# Altium schematic sheet [05]-CPU-UART,SPI.SchDoc: S32K1_CONTROLLER
size A3; SheetNumber: 05; SheetTotal: 11
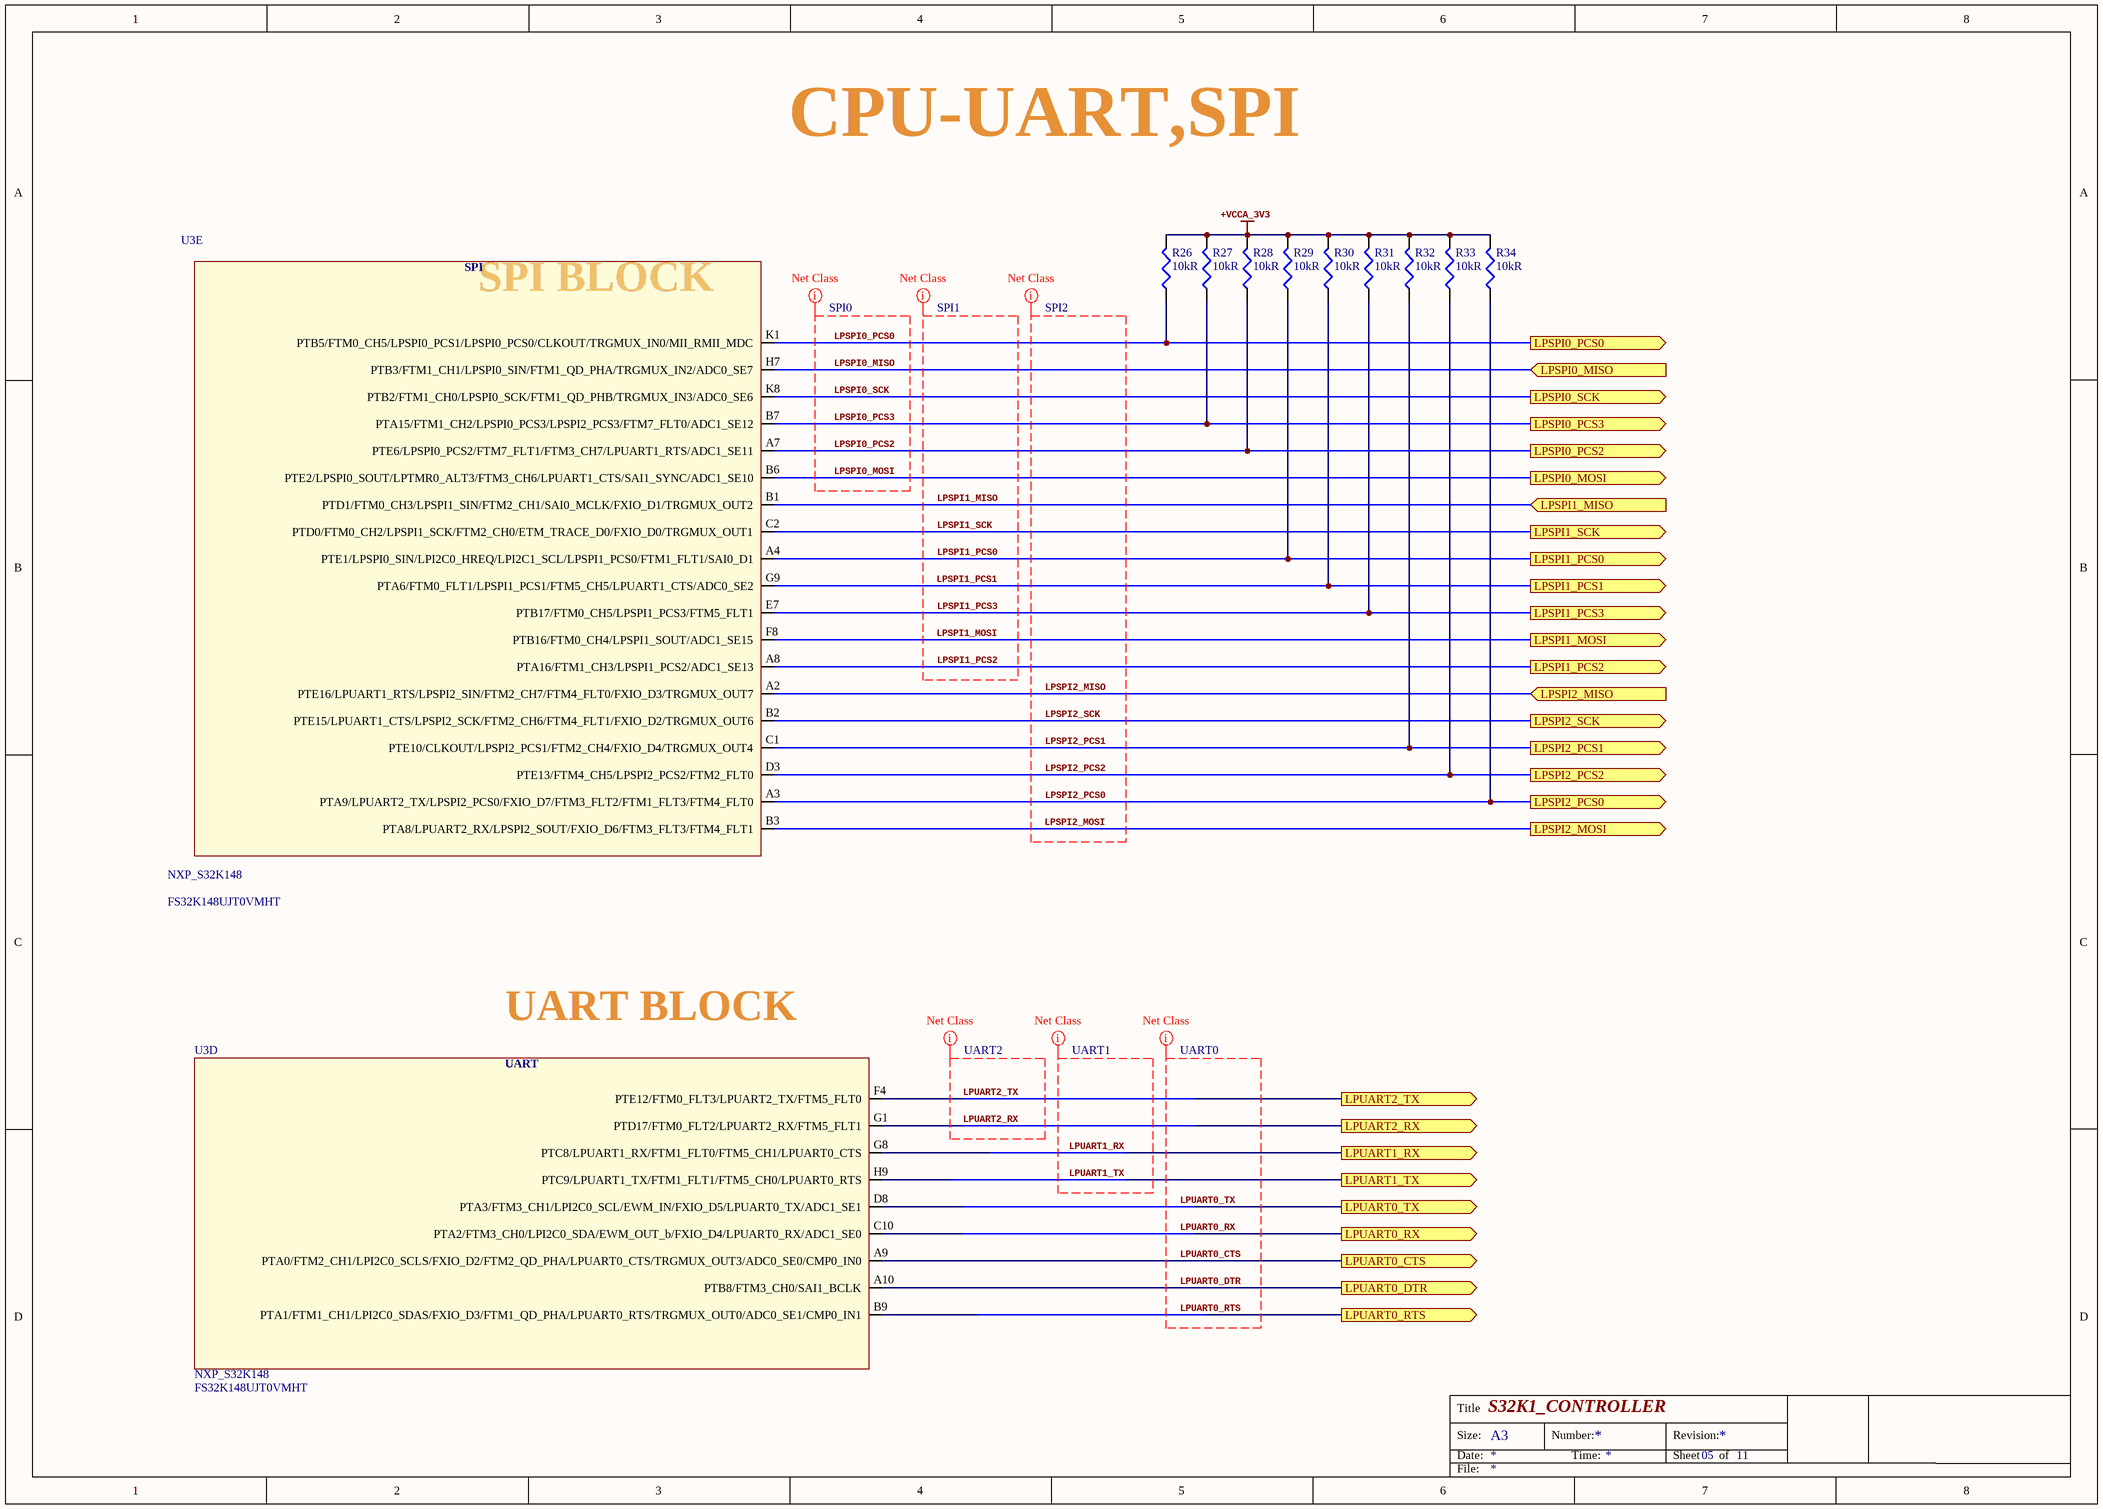
[diagram p0: [05]-CPU-UART,SPI.SchDoc]

## Parts
R26  Resistance: 10kR  [RES0402]  (hidden comment: ERJ-2GEJ103X)
R27  Resistance: 10kR  [RES0402]  (hidden comment: ERJ-2GEJ103X)
R28  Resistance: 10kR  [RES0402]  (hidden comment: ERJ-2GEJ103X)
R29  Resistance: 10kR  [RES0402]  (hidden comment: ERJ-2GEJ103X)
R30  Resistance: 10kR  [RES0402]  (hidden comment: ERJ-2GEJ103X)
R31  Resistance: 10kR  [RES0402]  (hidden comment: ERJ-2GEJ103X)
R32  Resistance: 10kR  [RES0402]  (hidden comment: ERJ-2GEJ103X)
R33  Resistance: 10kR  [RES0402]  (hidden comment: ERJ-2GEJ103X)
R34  Resistance: 10kR  [RES0402]  (hidden comment: ERJ-2GEJ103X)
U3  NXP_S32K148  Manufacturer Part Number: FS32K148UJT0VMHT  [WEONREFERENCEPLATFORM_100MAPBGA]  (parts D,E of 8)

## Ports
LPSPI0_MISO (in), LPSPI0_MOSI (out), LPSPI0_PCS0 (out), LPSPI0_PCS2 (out), LPSPI0_PCS3 (out), LPSPI0_SCK (out), LPSPI1_MISO (in), LPSPI1_MOSI (out), LPSPI1_PCS0 (out), LPSPI1_PCS1 (out), LPSPI1_PCS2 (out), LPSPI1_PCS3 (out), LPSPI1_SCK (out), LPSPI2_MISO (in), LPSPI2_MOSI (out), LPSPI2_PCS0 (out), LPSPI2_PCS1 (out), LPSPI2_PCS2 (out), LPSPI2_SCK (out), LPUART0_CTS (out), LPUART0_DTR (out), LPUART0_RTS (out), LPUART0_RX (out), LPUART0_TX (out), LPUART1_RX (out), LPUART1_TX (out), LPUART2_RX (out), LPUART2_TX (out)

## Nets
+VCCA_3V3: R26.2 R27.2 R28.2 R29.2 R30.2 R31.2 R32.2 R33.2 R34.2
LPSPI0_MISO: U3.H7(PTB3/FTM1_CH1/LPSPI0_SIN/FTM1_QD_PHA/TRGMUX_IN2/ADC0_SE7) ; port LPSPI0_MISO
LPSPI0_MOSI: U3.B6(PTE2/LPSPI0_SOUT/LPTMR0_ALT3/FTM3_CH6/LPUART1_CTS/SAI1_SYNC/ADC1_SE10) ; port LPSPI0_MOSI
LPSPI0_PCS0: R26.1 U3.K1(PTB5/FTM0_CH5/LPSPI0_PCS1/LPSPI0_PCS0/CLKOUT/TRGMUX_IN0/MII_RMII_MDC) ; port LPSPI0_PCS0
LPSPI0_PCS2: R28.1 U3.A7(PTE6/LPSPI0_PCS2/FTM7_FLT1/FTM3_CH7/LPUART1_RTS/ADC1_SE11) ; port LPSPI0_PCS2
LPSPI0_PCS3: R27.1 U3.B7(PTA15/FTM1_CH2/LPSPI0_PCS3/LPSPI2_PCS3/FTM7_FLT0/ADC1_SE12) ; port LPSPI0_PCS3
LPSPI0_SCK: U3.K8(PTB2/FTM1_CH0/LPSPI0_SCK/FTM1_QD_PHB/TRGMUX_IN3/ADC0_SE6) ; port LPSPI0_SCK
LPSPI1_MISO: U3.B1(PTD1/FTM0_CH3/LPSPI1_SIN/FTM2_CH1/SAI0_MCLK/FXIO_D1/TRGMUX_OUT2) ; port LPSPI1_MISO
LPSPI1_MOSI: U3.F8(PTB16/FTM0_CH4/LPSPI1_SOUT/ADC1_SE15) ; port LPSPI1_MOSI
LPSPI1_PCS0: R29.1 U3.A4(PTE1/LPSPI0_SIN/LPI2C0_HREQ/LPI2C1_SCL/LPSPI1_PCS0/FTM1_FLT1/SAI0_D1) ; port LPSPI1_PCS0
LPSPI1_PCS1: R30.1 U3.G9(PTA6/FTM0_FLT1/LPSPI1_PCS1/FTM5_CH5/LPUART1_CTS/ADC0_SE2) ; port LPSPI1_PCS1
LPSPI1_PCS2: U3.A8(PTA16/FTM1_CH3/LPSPI1_PCS2/ADC1_SE13) ; port LPSPI1_PCS2
LPSPI1_PCS3: R31.1 U3.E7(PTB17/FTM0_CH5/LPSPI1_PCS3/FTM5_FLT1) ; port LPSPI1_PCS3
LPSPI1_SCK: U3.C2(PTD0/FTM0_CH2/LPSPI1_SCK/FTM2_CH0/ETM_TRACE_D0/FXIO_D0/TRGMUX_OUT1) ; port LPSPI1_SCK
LPSPI2_MISO: U3.A2(PTE16/LPUART1_RTS/LPSPI2_SIN/FTM2_CH7/FTM4_FLT0/FXIO_D3/TRGMUX_OUT7) ; port LPSPI2_MISO
LPSPI2_MOSI: U3.B3(PTA8/LPUART2_RX/LPSPI2_SOUT/FXIO_D6/FTM3_FLT3/FTM4_FLT1) ; port LPSPI2_MOSI
LPSPI2_PCS0: R34.1 U3.A3(PTA9/LPUART2_TX/LPSPI2_PCS0/FXIO_D7/FTM3_FLT2/FTM1_FLT3/FTM4_FLT0) ; port LPSPI2_PCS0
LPSPI2_PCS1: R32.1 U3.C1(PTE10/CLKOUT/LPSPI2_PCS1/FTM2_CH4/FXIO_D4/TRGMUX_OUT4) ; port LPSPI2_PCS1
LPSPI2_PCS2: R33.1 U3.D3(PTE13/FTM4_CH5/LPSPI2_PCS2/FTM2_FLT0) ; port LPSPI2_PCS2
LPSPI2_SCK: U3.B2(PTE15/LPUART1_CTS/LPSPI2_SCK/FTM2_CH6/FTM4_FLT1/FXIO_D2/TRGMUX_OUT6) ; port LPSPI2_SCK
LPUART0_CTS: U3.A9(PTA0/FTM2_CH1/LPI2C0_SCLS/FXIO_D2/FTM2_QD_PHA/LPUART0_CTS/TRGMUX_OUT3/ADC0_SE0/CMP0_IN0) ; port LPUART0_CTS
LPUART0_DTR: U3.A10(PTB8/FTM3_CH0/SAI1_BCLK) ; port LPUART0_DTR
LPUART0_RTS: U3.B9(PTA1/FTM1_CH1/LPI2C0_SDAS/FXIO_D3/FTM1_QD_PHA/LPUART0_RTS/TRGMUX_OUT0/ADC0_SE1/CMP0_IN1) ; port LPUART0_RTS
LPUART0_RX: U3.C10(PTA2/FTM3_CH0/LPI2C0_SDA/EWM_OUT_b/FXIO_D4/LPUART0_RX/ADC1_SE0) ; port LPUART0_RX
LPUART0_TX: U3.D8(PTA3/FTM3_CH1/LPI2C0_SCL/EWM_IN/FXIO_D5/LPUART0_TX/ADC1_SE1) ; port LPUART0_TX
LPUART1_RX: U3.G8(PTC8/LPUART1_RX/FTM1_FLT0/FTM5_CH1/LPUART0_CTS) ; port LPUART1_RX
LPUART1_TX: U3.H9(PTC9/LPUART1_TX/FTM1_FLT1/FTM5_CH0/LPUART0_RTS) ; port LPUART1_TX
LPUART2_RX: U3.G1(PTD17/FTM0_FLT2/LPUART2_RX/FTM5_FLT1) ; port LPUART2_RX
LPUART2_TX: U3.F4(PTE12/FTM0_FLT3/LPUART2_TX/FTM5_FLT0) ; port LPUART2_TX

## Layout directives
net class SPI0: LPSPI0_MISO, LPSPI0_MOSI, LPSPI0_PCS0, LPSPI0_PCS2, LPSPI0_PCS3, LPSPI0_SCK
net class SPI1: LPSPI1_MISO, LPSPI1_MOSI, LPSPI1_PCS0, LPSPI1_PCS1, LPSPI1_PCS2, LPSPI1_PCS3, LPSPI1_SCK
net class SPI2: LPSPI2_MISO, LPSPI2_MOSI, LPSPI2_PCS0, LPSPI2_PCS1, LPSPI2_PCS2, LPSPI2_SCK
net class UART2: LPUART2_RX, LPUART2_TX
net class UART1: LPUART1_RX, LPUART1_TX
net class UART0: LPUART0_CTS, LPUART0_DTR, LPUART0_RTS, LPUART0_RX, LPUART0_TX

## Notes on the sheet
- CPU-UART,SPI
- SPI BLOCK
- UART BLOCK
- Labels drawn without touching a wire or pin: +VCCA_3V3
- Title
- Size:
- Date:
- A3
- Number:
- Time:
- Revision:
- Sheet
- of
- File:
- (in symbol NXP_S32K148, part D) UART
- (in symbol NXP_S32K148, part E) SPI

## Library data of the parts
R26-R34 = ERJ-2GEJ103X: Res Thick Film 0402 10K Ohm 5% 1/10W ±200ppm/°C Molded SMD SMD Punched Carrier T/R; Manufacturer: Panasonic; Power Rating: 100mW; Voltage Rating: 50V; Supplier 1: Digi-Key; Manufacturer Part Number: ERJ-2GEJ103X; Stock 1: 15334974; Pricing 1: 1 = 0.10000, 10 = 0.03100, 100 = 0.01250, 1000 = 0.00560, 2500 = 0.00486, 5000 = 0.00401 (USD); Mount: Surface Mount; Case/Package: 0402; Case Code (Metric): 1005; Case Code (Imperial): 0402; Contact Plating: Tin; Min Operating Temperature: -55°C; Max Operating Temperature: 155°C; Packaging: Cut Tape; Tolerance: 5%; Package Quantity: 1; Composition: Thick Film; Number of Terminations: 2; Termination: SMD/SMT; Military Standard: Not; Temperature Coefficient: 200ppm/°C; Max Power Dissipation: 100mW; Voltage Rating (DC): 50V; Features: Automotive AEC-Q200; Length: 1mm; Height: 0.35mm; Width: 0.02inch; Depth: 0.5mm; Radiation Hardening: No; REACH SVHC: No SVHC; Lead Free: Lead Free; ComponentLink1URL: http://industrial.panasonic.com/www-data/pdf/AOA0000/AOA0000CE1.pdf?src-supplier=Avnet+Europe; ComponentLink1Description: http://industrial.panasonic.com/www-data/pdf/AOA0000/AOA0000CE1.pdf?src-supplier=Avnet+Europe; ComponentLink2URL: http://www.farnell.com/datasheets/1678796.pdf?src-supplier=Element14; ComponentLink2Description: http://www.farnell.com/datasheets/1678796.pdf?src-supplier=Element14; ComponentLink3URL: http://www.mouser.com/ds/2/315/AOA0000CE1-37422.pdf?src-supplier=Mouser; ComponentLink3Description: http://www.mouser.com/ds/2/315/AOA0000CE1-37422.pdf?src-supplier=Mouser; ComponentLink4URL: http://www.farnell.com/datasheets/2059623.pdf?src-supplier=Farnell; ComponentLink4Description: http://www.farnell.com/datasheets/2059623.pdf?src-supplier=Farnell; ComponentLink5URL: https://www.alliedelec.com/m/d/51cd0790071e1666bdb9d00c57fcf960.pdf?src-supplier=Allied+Electronics; ComponentLink5Description: https://www.alliedelec.com/m/d/51cd0790071e1666bdb9d00c57fcf960.pdf?src-supplier=Allied+Electronics; ComponentLink6URL: http://www.jameco.com/Jameco/Products/ProdDS/1935721.pdf?src-supplier=Jameco; ComponentLink6Description: http://www.jameco.com/Jameco/Products/ProdDS/1935721.pdf?src-supplier=Jameco; ComponentLink7URL: http://industrial.panasonic.com/www-data/pdf/AOA0000/AOA0000CE1.pdf?src-supplier=Avnet; ComponentLink7Description: http://industrial.panasonic.com/www-data/pdf/AOA0000/AOA0000CE1.pdf?src-supplier=Avnet; ComponentLink8URL: http://datasheet.octopart.com/ERJ-2GEJ103X-Panasonic-datasheet-13266872.pdf?src-supplier=Newark; ComponentLink8Description: http://datasheet.octopart.com/ERJ-2GEJ103X-Panasonic-datasheet-13266872.pdf?src-supplier=Newark; ComponentLink9URL: http://datasheet.octopart.com/ERJ-2GEJ103X-Panasonic-datasheet-61114972.pdf?src-supplier=Farnell; ComponentLink9Description: http://datasheet.octopart.com/ERJ-2GEJ103X-Panasonic-datasheet-61114972.pdf?src-supplier=Farnell; ComponentLink10URL: http://datasheet.octopart.com/ERJ-2GEJ103X-Panasonic-datasheet-5314550.pdf?src-supplier=Element14; ComponentLink10Description: http://datasheet.octopart.com/ERJ-2GEJ103X-Panasonic-datasheet-5314550.pdf?src-supplier=Element14; ComponentLink11URL: http://datasheet.octopart.com/ERJ-2GEJ103X-Panasonic-datasheet-78375410.pdf; ComponentLink11Description: http://datasheet.octopart.com/ERJ-2GEJ103X-Panasonic-datasheet-78375410.pdf; ComponentLink12URL: http://datasheet.octopart.com/ERJ-2GEJ103X-Panasonic-datasheet-17720667.pdf?src-supplier=Jameco; ComponentLink12Description: http://datasheet.octopart.com/ERJ-2GEJ103X-Panasonic-datasheet-17720667.pdf?src-supplier=Jameco; ComponentLink13URL: http://datasheet.octopart.com/ERJ-2GEJ103X-Panasonic-datasheet-37173568.pdf?src-supplier=Electro+Sonic; ComponentLink13Description: http://datasheet.octopart.com/ERJ-2GEJ103X-Panasonic-datasheet-37173568.pdf?src-supplier=Electro+Sonic; ComponentLink14URL: http://datasheet.octopart.com/ERJ-2GEJ103X-Panasonic-datasheet-118598.pdf?src-supplier=Digi-Key; ComponentLink14Description: http://datasheet.octopart.com/ERJ-2GEJ103X-Panasonic-datasheet-118598.pdf?src-supplier=Digi-Key; ComponentLink15URL: http://datasheet.octopart.com/ERJ-2GEJ103X-Panasonic-datasheet-5313456.pdf?src-supplier=Farnell; ComponentLink15Description: http://datasheet.octopart.com/ERJ-2GEJ103X-Panasonic-datasheet-5313456.pdf?src-supplier=Farnell; ComponentLink16URL: http://datasheet.octopart.com/ERJ-2GEJ103X-Panasonic-datasheet-10554283.pdf?src-supplier=Farnell; ComponentLink16Description: http://datasheet.octopart.com/ERJ-2GEJ103X-Panasonic-datasheet-10554283.pdf?src-supplier=Farnell; ComponentLink17URL: http://datasheet.octopart.com/ERJ-2GEJ103X-Panasonic-datasheet-11480398.pdf?src-supplier=Arrow; ComponentLink17Description: http://datasheet.octopart.com/ERJ-2GEJ103X-Panasonic-datasheet-11480398.pdf?src-supplier=Arrow; ComponentLink18URL: http://datasheet.octopart.com/ERJ-2GEJ103X-Panasonic---ECG-datasheet-15994758.pdf?src-supplier=Farnell; ComponentLink18Description: http://datasheet.octopart.com/ERJ-2GEJ103X-Panasonic---ECG-datasheet-15994758.pdf?src-supplier=Farnell; ComponentLink19URL: http://datasheet.octopart.com/ERJ2GEJ103X-Panasonic-datasheet-27908757.pdf?src-supplier=Electro+Sonic; ComponentLink19Description: http://datasheet.octopart.com/ERJ2GEJ103X-Panasonic-datasheet-27908757.pdf?src-supplier=Electro+Sonic; ComponentLink20URL: http://datasheet.octopart.com/Thick-Film-Chip-Resistors-Panasonic-datasheet-family-105.pdf; ComponentLink20Description: http://datasheet.octopart.com/Thick-Film-Chip-Resistors-Panasonic-datasheet-family-105.pdf; Supplier Part Number 1: P10KJCT-ND
U3 = NXP_S32K148: Manufacturer: NXP Semiconductors; Supplier 1: Digikey; Stock 1: 855; Pricing 1: 1 = 16.32000, 10 = 14.99600, 25 = 14.37440, 100 = 12.66510, 880 = 11.26650 (USD); Supplier Part Number 1: 568-13929-ND